# Altium project DummyLoadAddOn.PrjPcb
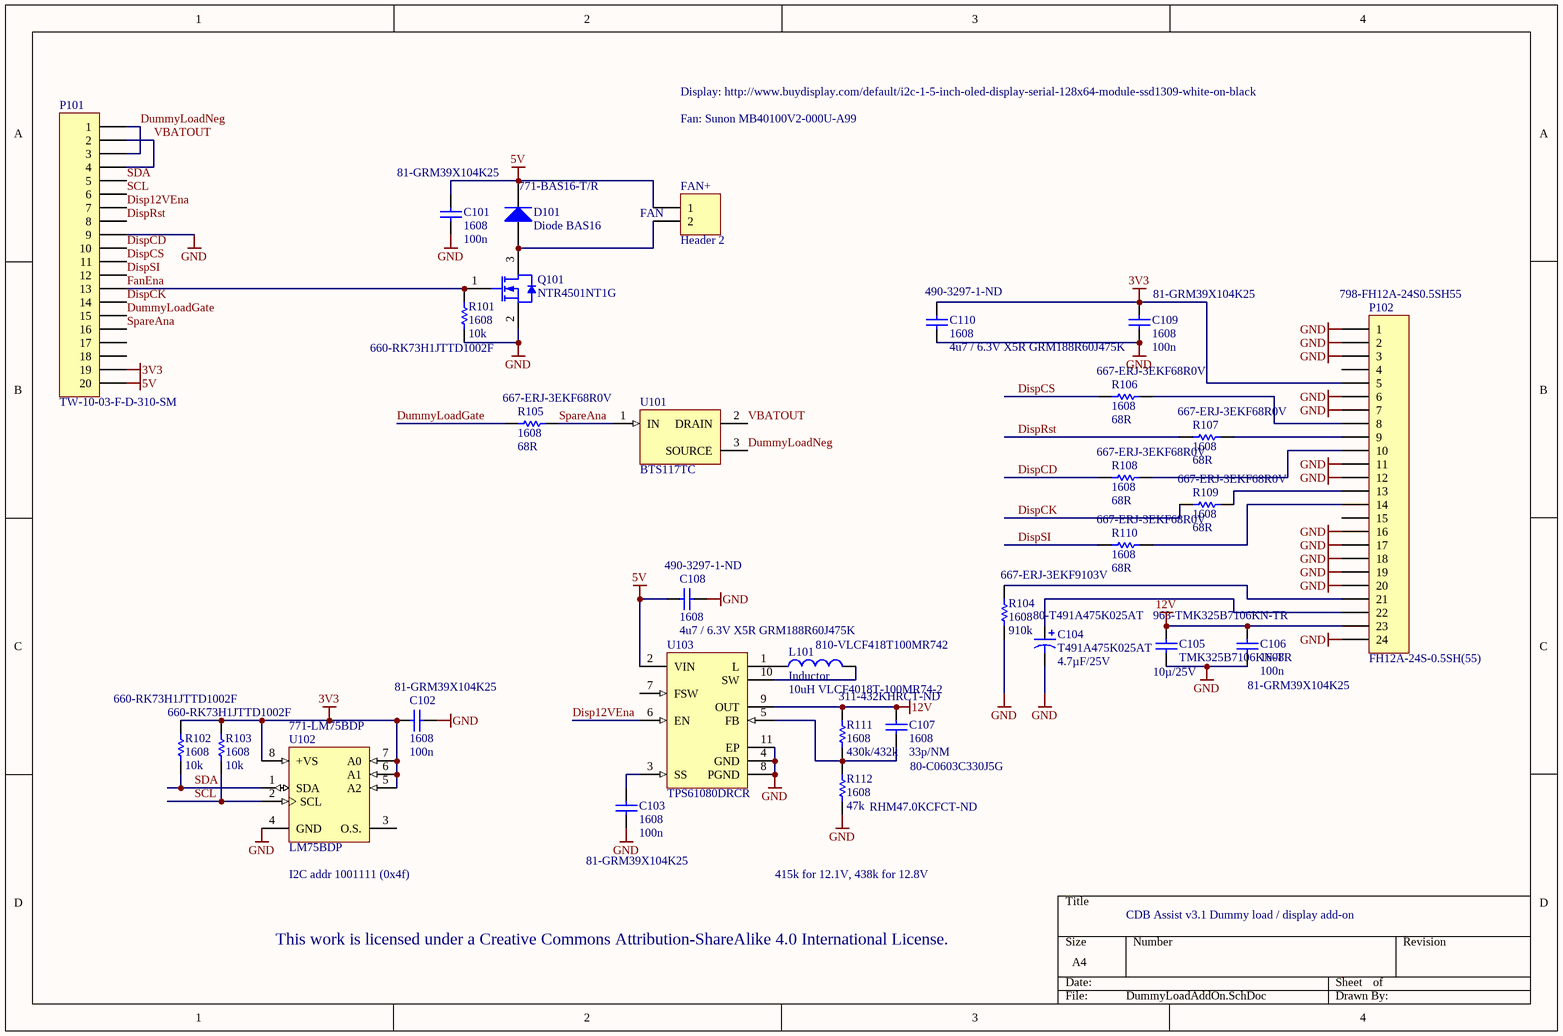
[diagram p0: DummyLoadAddOn.SchDoc]
1 sheet, 31 parts. Net scope: global (net labels, ports and power ports of the same name join across sheets).
Board file: DummyLoadAddOn.PcbDoc

## Sheet DummyLoadAddOn.SchDoc
size A4

### Parts
C101  1608  value 100n  Supplier Part Number 1: 81-GRM39X104K25  [RESC1608N]
C102  1608  value 100n  Supplier Part Number 1: 81-GRM39X104K25  [RESC1608N]
C103  1608  value 100n  Supplier Part Number 1: 81-GRM39X104K25  [RESC1608N]
C104  T491A475K025AT  value 4.7µF/25V  Supplier Part Number 1: 80-T491A475K025AT  [A_3216]
C105  TMK325B7106KN-TR  value 10µ/25V  Supplier Part Number 1: 963-TMK325B7106KN-TR  [CAPC3225N]
C106  1608  value 100n  Supplier Part Number 1: 81-GRM39X104K25  [RESC1608N]
C107  1608  value 33p/NM  Supplier Part Number 1: 80-C0603C330J5G  [RESC1608N]
C108  1608  value 4u7 / 6.3V X5R GRM188R60J475K  Supplier Part Number 1: 490-3297-1-ND  [RESC1608N]
C109  1608  value 100n  Supplier Part Number 1: 81-GRM39X104K25  [RESC1608N]
C110  1608  value 4u7 / 6.3V X5R GRM188R60J475K  Supplier Part Number 1: 490-3297-1-ND  [RESC1608N]
D101  Diode BAS16  Supplier Part Number 1: 771-BAS16-T/R  [SOT-23_N]
FAN+  Header 2  [HDR1X2]  (no BOM)
L101  Inductor  value 10uH VLCF4018T-100MR74-2  Supplier Part Number 1: 810-VLCF418T100MR742  [SRR4018]
P101  TW-10-03-F-D-310-SM  [Samtec TW-SM 20-pin]
P102  FH12A-24S-0.5SH(55)  Supplier Part Number 1: 798-FH12A-24S0.5SH55  [MI050DXK-24-1 - duplicate]
Q101  NTR4501NT1G  [ONSC-SOT-23-3-318-08_V]
R101  1608  value 10k  Supplier Part Number 1: 660-RK73H1JTTD1002F  [RESC1608N]
R102  1608  value 10k  Supplier Part Number 1: 660-RK73H1JTTD1002F  [RESC1608N]
R103  1608  value 10k  Supplier Part Number 1: 660-RK73H1JTTD1002F  [RESC1608N]
R104  1608  value 910k  Supplier Part Number 1: 667-ERJ-3EKF9103V  [RESC1608N]
R105  1608  value 68R  Supplier Part Number 1: 667-ERJ-3EKF68R0V  [RESC1608N]
R106  1608  value 68R  Supplier Part Number 1: 667-ERJ-3EKF68R0V  [RESC1608N]
R107  1608  value 68R  Supplier Part Number 1: 667-ERJ-3EKF68R0V  [RESC1608N]
R108  1608  value 68R  Supplier Part Number 1: 667-ERJ-3EKF68R0V  [RESC1608N]
R109  1608  value 68R  Supplier Part Number 1: 667-ERJ-3EKF68R0V  [RESC1608N]
R110  1608  value 68R  Supplier Part Number 1: 667-ERJ-3EKF68R0V  [RESC1608N]
R111  1608  value 430k/432k  Supplier Part Number 1: 311-432KHRCT-ND  [RESC1608N]
R112  1608  value 47k  Supplier Part Number 1: RHM47.0KCFCT-ND  [RESC1608N]
U101  BTS117TC  [INF-PG-TO263-3-2_N]
U102  LM75BDP  Supplier Part Number 1: 771-LM75BDP  [MUA08A_N]
U103  TPS61080DRCR  [TI-DRC10-2400X1650TP_V]

### Nets
3V3: C102.2 C109.1 C110.1 P101.19 P102.5 R102.2 R103.2 U102.5(A2) U102.6(A1) U102.7(A0) U102.8(+VS)
5V: C101.2 C108.2 D101.3(K) FAN+.1 P101.20 U103.2(VIN)
12V: C105.1 C106.2 C107.2 P102.23 R111.1 U103.9(OUT)
GND: C101.1 C102.1 C103.1 C104.2 C105.2 C106.1 C108.1 C109.2 C110.2 P101.9 P102.1 P102.2 P102.3 P102.6 P102.7 P102.11 P102.12 P102.16 P102.17 P102.18 P102.19 P102.20 P102.24 Q101.2(S) R101.1 R104.2 R112.2 U102.4(GND) U103.4(GND) U103.8(PGND) U103.11(EP)
Disp12VEna: P101.7 U103.6(EN)
DispCD: P101.10 R108.2
DispCK: P101.14 R109.2
DispCS: P101.11 R106.2
DispRst: P101.8 R107.2
DispSI: P101.12 R110.2
DummyLoadGate: P101.15 R105.2
DummyLoadNeg: P101.1 P101.3 U101.3(SOURCE)
FanEna: P101.13 Q101.1(G) R101.2
SCL: P101.6 R103.1 U102.2(SCL)
SDA: P101.5 R102.1 U102.1(SDA)
SpareAna: P101.16 R105.1 U101.1(IN)
VBATOUT: P101.2 P101.4 U101.2(DRAIN)
NetC103_2: C103.2 U103.3(SS)
NetC104_1: C104.1 P102.22
NetC107_1: C107.1 R111.2 R112.1 U103.5(FB)
NetD101_1: D101.1(A) FAN+.2 Q101.3(D)
NetL101_1: L101.1 U103.1(L)
NetL101_2: L101.2 U103.10(SW)
NetP102_8: P102.8 R106.1
NetP102_9: P102.9 R107.1
NetP102_10: P102.10 R108.1
NetP102_13: P102.13 R109.1
NetP102_14: P102.14 R110.1
NetP102_21: P102.21 R104.1

Not connected (* = marked no-connect by the designer): P101 17 18; P102 4 15; U102 3(O.S.); U103 7(FSW)

### Notes on the sheet
- Display: http://www.buydisplay.com/default/i2c-1-5-inch-oled-display-serial-128x64-module-ssd1309-white-on-black
- Fan: Sunon MB40100V2-000U-A99
- (near FAN+) FAN
- (near U102) I2C addr 1001111 (0x4f)
- 415k for 12.1V, 438k for 12.8V
- CDB Assist v3.1 Dummy load / display add-on
- This work is licensed under a Creative Commons Attribution-ShareAlike 4.0 International License.

### Library data of the parts
C101-C103 C106 C109 = Cap Semi: Capacitor (Semiconductor SIM Model); Manufacturer: Murata Electronics; Manufacturer Part Number: GRM188R71E104KA01D; Capacitance: 0.1 uF; Tolerance: 10 %; Type: General Purpose MLCC; Voltage Rating DC: 25 V; Case Height: 0.8 mm; Case Length: 1.6 mm; Dielectric: X7R; Temperature Coefficient / Code: +/- 15 %; Published: 8-Jun-2000; LatestRevisionDate: 29-May-2009; LatestRevisionNote: IPC-7351 Footprint Added.; PackageReference: C1206; Publisher: Altium Limited; PackageDescription: Chip Capacitor; Supplier 1: Mouser; RoHS: RoHS Compliant; Category: Multilayer Ceramic Capacitors MLCC - SMD/SMT; Stock 1: 1414567; Pricing 1: 1=0.100, 10=0.011, 100=0.007, 1000=0.005, 4000=0.004, 48000=0.003 (USD); Operating Temperature Range: - 55 C to + 125 C; Package / Case: 0603 (1608 metric); Packaging: Reel; Product: General Type MLCCs; Series: GRM; Termination Style: SMD/SMT; Brand: Murata Electronics; Case Code - in: 0603; Case Code - mm: 1608; Case Width: 0.8 mm; Maximum Operating Temperature: + 125 C; Minimum Operating Temperature: - 55 C; Product Category: Low & Medium Capacitance SMD Ceramic Chip Capacitors; Standard Pack Qty: 4000; RoHS - Mouser: Y; Minimum Order Quantity: 1; Reeling: True; ComponentLink1URL: http://www.murata.com/products/catalog/pdf/c02e.pdf; ComponentLink1Description: http://www.murata.com/products/catalog/pdf/c02e.pdf
C104 = T491A: Solid Tantalum Chip Capacitor, Standard T491 Series - Industrial Grade; Manufacturer: Kemet; Mfr Case Code: A Case; Capacitance: 4.7 uF; Tolerance: 10 %; Voltage Rating: 25 V; Case Length: 3.2 mm; Case Width: 1.6 mm; Published: 17-Jul-2002; LatestRevisionDate: 19-Mar-2004; LatestRevisionNote: Silkscreen dimensions re-sized.; DatasheetDocument: Mar-2001; PackageDocument: Mar-2001; PackageReference: A; Publisher: Altium Limited; Code_JEITA: 3216-18; ComponentLink1Description: Manufacturer Link; ComponentLink1URL: http://www.kemet.com/; ComponentLink2Description: Datasheet; ComponentLink2URL: http://www.kemet.com/kemet/web/homepage/kechome.nsf/vapubfilesname/F3102TA.pdf/$file/F3102TA.pdf; Supplier 1: Mouser; Manufacturer Part Number: T491A475K025AT; RoHS: RoHS Compliant; Category: Tantalum Capacitors - Solid SMD; Stock 1: 10849; Pricing 1: 1=0.430, 10=0.230, 100=0.138, 1000=0.125, 2000=0.092, 10000=0.085, 24000=0.082, 50000=0.077, 100000=0.071 (USD); Height: 1.8 mm; Operating Temperature Range: - 55 C to + 125 C; Package / Case: 1206 (3216 metric); Packaging: Reel; Product: Tantalum Solid Standard Grade - Other Various; Series: T491; Termination Style: SMD/SMT; Brand: Kemet; Case Code - in: 1206; Case Code - mm: 3216; Product Category: SMD Tantalum Chip Capacitors; Standard Pack Qty: 2000; RoHS - Mouser: Y; Minimum Order Quantity: 1; Reeling: True; ComponentLink3URL: http://www.mouser.com/ds/2/212/KEM_T2005_T491-533941.pdf; ComponentLink3Description: http://www.mouser.com/ds/2/212/KEM_T2005_T491-533941.pdf
C105 = cap: Capacitor; Manufacturer: Taiyo Yuden; Capacitance: 10 uF; Tolerance: 10 %; Type: Multilayer Ceramic Capacitor; Voltage Rating DC: 25 V; Case Height: 1.9 mm; Case Length: 3.2 mm; Case Width: 2.5 mm; Dielectric: X7R; Temperature Coefficient / Code: +/- 15 %; Published: 8-Jun-2000; LatestRevisionDate: 17-Jul-2002; LatestRevisionNote: Re-released for DXP Platform.; PackageReference: RAD-0.3; Publisher: Altium Limited; Supplier 1: Mouser; Manufacturer Part Number: TMK325B7106KN-TR; RoHS: RoHS Compliant; Category: Multilayer Ceramic Capacitors MLCC - SMD/SMT; Stock 1: 26759; Pricing 1: 1=0.480, 10=0.255, 100=0.153, 1000=0.138, 2000=0.102, 10000=0.093, 24000=0.090, 50000=0.084, 100000=0.078 (USD); Operating Temperature Range: - 55 C to + 125 C; Package / Case: 1210 (3225 metric); Packaging: Reel; Product: General Type MLCCs; Series: M; Termination Style: SMD/SMT; Brand: Taiyo Yuden; Case Code - in: 1210; Case Code - mm: 3225; Maximum Operating Temperature: + 125 C; Minimum Operating Temperature: - 55 C; Standard Pack Qty: 2000; RoHS - Mouser: Y; Minimum Order Quantity: 1; Reeling: True; ComponentLink1URL: http://www.yuden.co.jp/productdata/catalog/en/mlcc01_e.pdf; ComponentLink1Description: http://www.yuden.co.jp/productdata/catalog/en/mlcc01_e.pdf
C107 = Cap Semi: Capacitor (Semiconductor SIM Model); Manufacturer: Kemet; Manufacturer Part Number: C0603C330J5GACTU; Capacitance: 33 pF; Tolerance: 5 %; Type: SMD MLCC C0G 10 - 250 VDC Commercial Grade; Voltage Rating DC: 50 V; Case Length: 1.6 mm; Case Width: 0.8 mm; Class: Class 1; Dielectric: C0G (NP0); Dissipation Factor DF: 0.1; Temperature Coefficient / Code: +/- 30 PPM / C; Published: 8-Jun-2000; LatestRevisionDate: 29-May-2009; LatestRevisionNote: IPC-7351 Footprint Added.; PackageReference: C1206; Publisher: Altium Limited; PackageDescription: Chip Capacitor; Supplier 1: Mouser; RoHS: RoHS Compliant; Category: Multilayer Ceramic Capacitors MLCC - SMD/SMT; Stock 1: 167004; Pricing 1: 1=0.100, 10=0.014, 100=0.009, 4000=0.006, 24000=0.005, 48000=0.004, 100000=0.003 (USD); Operating Temperature Range: - 55 C to + 125 C; Package / Case: 0603 (1608 metric); Packaging: Reel; Product: General Type MLCCs; Series: C0603C; Termination Style: SMD/SMT; Voltage Rating AC: -; Brand: Kemet; Case Code - in: 0603; Case Code - mm: 1608; Case Height: -; Lead Spacing: 0.7 mm; Maximum Operating Temperature: + 125 C; Minimum Operating Temperature: - 55 C; Product Category: 0603 SMD Ceramic Chip Capacitors; Standard Pack Qty: 4000; RoHS - Mouser: Y; Minimum Order Quantity: 1; Reeling: True; ComponentLink1URL: http://www.kemet.com/Lists/ProductCatalog/Attachments/46/KEM_C1003_C0G_SMD.pdf; ComponentLink1Description: http://www.kemet.com/Lists/ProductCatalog/Attachments/46/KEM_C1003_C0G_SMD.pdf
C108 C110 = Cap Semi: Capacitor (Semiconductor SIM Model); Manufacturer: Murata Electronics North America; Manufacturer Part Number: GRM188R60J475KE19D; Capacitance: 4.7µF; Tolerance: ±10%; Voltage - Rated: 6.3V; Temperature Coefficient: X5R; Published: 8-Jun-2000; LatestRevisionDate: 29-May-2009; LatestRevisionNote: IPC-7351 Footprint Added.; PackageReference: C1206; Publisher: Altium Limited; PackageDescription: Chip Capacitor; Supplier 1: Digi-Key; RoHS: RoHS Compliant; Category: Capacitors; Stock 1: 658756; Pricing 1: 1=0.12, 10=0.08, 50=0.046, 100=0.038, 250=0.032, 500=0.0268, 1000=0.022 (USD); Packaging: Cut Tape (CT); Mounting Type: Surface Mount, MLCC; Operating Temperature: -55°C ~ 85°C; Applications: General Purpose; Ratings: -; Package / Case: 0603 (1608 Metric); Size / Dimension: 0.063" L x 0.031" W (1.60mm x 0.80mm); Height - Seated (Max): -; Thickness (Max): 0.035" (0.90mm); Lead Spacing: -; Features: -; Lead Style: -; ComponentLink1URL: http://www.murata.com/~/media/webrenewal/support/library/catalog/products/capacitor/mlcc/c02e.ashx; ComponentLink1Description: http://www.murata.com/~/media/webrenewal/support/library/catalog/products/capacitor/mlcc/c02e.ashx
D101 = Diode BAS16: Silicon Switching Diode for High-Speed Switching; Manufacturer: NXP Semiconductors; Manufacturer Part Number: BAS16,215; Note: Pin 2 is not connected and not drawn.; Configuration: Single; Forward Continuous Current: 0.215 A; Max Surge Current: 4 A; Recovery Time: 4 ns; Forward Voltage Drop: 1.25 V at 0.15 A; Maximum Reverse Leakage Current: 0.5 uA at 80 V; Peak Reverse Voltage: 100 V; Published: 21-Mar-2003; LatestRevisionDate: 29-May-2009; LatestRevisionNote: IPC-7351 Footprint Added.; DatasheetVersion: Oct-1999; PackageVersion: Sep-2001; PackageReference: SOT-23; Publisher: Altium Limited; PackageDescription: 3-Pin SOT-23 Package 0.95 mm Pitch, 2.5 mm Lead Span; ComponentLink1Description: Manufacturer Link; ComponentLink1URL: http://www.infineon.com/; ComponentLink2Description: Datasheet; ComponentLink2URL: http://www.infineon.com/upload/Document/cmc_upload/documents/012/5331/bas16series.pdf; Supplier 1: Mouser; RoHS: RoHS Compliant; Category: Diodes - General Purpose, Power, Switching; Stock 1: 101735; Pricing 1: 1=0.130, 10=0.112, 100=0.039, 1000=0.027, 3000=0.020, 9000=0.017, 24000=0.016, 45000=0.014, 99000=0.012 (USD); Operating Temperature Range: + 150 C; Package / Case: TO-236AB; Packaging: Reel; Product: Switching Diodes; Brand: NXP Semiconductors; Mounting Style: SMD/SMT; Maximum Operating Temperature: + 150 C; Minimum Operating Temperature: - 65 C; Product Category: Diodes & Rectifiers - Single; Standard Pack Qty: 3000; RoHS - Mouser: Y; Minimum Order Quantity: 1; Reeling: True; ComponentLink3URL: http://www.mouser.com/ds/2/302/BAS16_SER-354545.pdf; ComponentLink3Description: http://www.mouser.com/ds/2/302/BAS16_SER-354545.pdf
FAN+ = Header 2: Header, 2-Pin; LatestRevisionDate: 17-Jul-2002; LatestRevisionNote: Re-released for DXP Platform.; Publisher: Altium Limited
L101 = Inductor: Manufacturer: TDK; Manufacturer Part Number: VLCF4018T-100MR74-2; Code_IEC: 1005; Inductance: 10 uH; Maximum DC Current: 740 mA; Maximum DC Resistance: 188 mOhms; Shielding: Shielded; Tolerance: 20 %; Case Height: 1.8 mm; Case Length: 4 mm; Test Frequency: 100 kHz; Published: 8-Jun-2000; LatestRevisionDate: 29-May-2009; LatestRevisionNote: IPC-7351 Footprint Added.; PackageReference: 0402-A; Publisher: Altium Limited; PackageDescription: Chip Inductor; Code_JEITA: 0402; Supplier 1: Mouser; RoHS: RoHS Compliant; Category: Fixed Inductors; Stock 1: 2442; Pricing 1: 1=0.900, 10=0.650, 100=0.520, 1000=0.340, 2000=0.310, 10000=0.300, 25000=0.290 (USD); Operating Temperature Range: - 40 C to + 105 C; Packaging: Reel; Product: Power Inductors; Series: VLCF; Termination Style: SMD/SMT; Brand: TDK; Case Width: 4 mm; Product Category: Wound SMD Inductors; Standard Pack Qty: 1000; RoHS - Mouser: Y; Minimum Order Quantity: 1; Reeling: True; ComponentLink1URL: http://www.mouser.com/ds/2/400/e531_vlcf-18500.pdf; ComponentLink1Description: http://www.mouser.com/ds/2/400/e531_vlcf-18500.pdf
P101 = Header 20: Header, 20-Pin; LatestRevisionDate: 17-Jul-2002; LatestRevisionNote: Re-released for DXP Platform.; Publisher: Altium Limited
P102 = Header 24: FPC 24-pin Display; Manufacturer: Hirose Connector; Current Rating: 500 mA; Gender: Female; Mounting Angle: Right; Number of Positions: 24; Voltage Rating: 50 V; Pitch: 0.5 mm; Contact Location: Top Contact; LatestRevisionDate: 17-Jul-2002; LatestRevisionNote: Re-released for DXP Platform.; Publisher: Altium Limited; Supplier 1: Mouser; Manufacturer Part Number: FH12A-24S-0.5SH(55); RoHS: RoHS Compliant; Category: FFC & FPC Connectors; Stock 1: 2070; Pricing 1: 1=2.10, 10=1.71, 100=1.64, 250=1.48, 500=1.36, 1000=1.17, 2000=0.994, 4000=0.944, 10000=0.923 (USD); Contact Plating: Gold; Housing Material: Liquid Crystal Polymer (LCP); Packaging: Reel; Series: FH12; Termination Style: SMD; Brand: Hirose Connector; Contact Material: Phosphor Bronze; Product Category: FFC/FPC Connectors; Product Type: Board Mount; Standard Pack Qty: 2000; RoHS - Mouser: Y; Minimum Order Quantity: 1; Reeling: True; ComponentLink1URL: http://www.mouser.com/ds/2/185/ed_FH12_20140305-355586.pdf; ComponentLink1Description: http://www.mouser.com/ds/2/185/ed_FH12_20140305-355586.pdf
Q101 = NTR4501NT1G: Power MOSFET, 20 V, 3.2 A, Single N-Channel, 3-Pin SOT-23, Pb-Free, Tape and Reel; Manufacturer: On Semiconductor; Channel Polarity: N Channel; Ciss Typ (pF): 200; Coss Typ (pF): 80; Crss Typ (pF): 50; PD Max (W): 1.25; Qrr Typ (nC): 3; V(BR)DSS Min (V): 20; VGS Max (V): 12; VGS(th) Max (V): 1.2; DatasheetVersion: Rev. 13; PackageVersion: Rev. AP, 11/2009; PackageReference: SOT-23-3-318-08; PackageDescription: 3-Pin Small Outline Transistor, Body 2.92 x 1.3 mm, Pitch 0.95 mm; Supplier 1: Digi-Key; Supplier Part Number 1: NTR4501NT1GOSTR-ND; Supplier 2: Digi-Key; Supplier Part Number 2: NTR4501NT1GOSCT-ND; Supplier 3: Digi-Key; Supplier Part Number 3: NTR4501NT1GOSDKR-ND; Supplier 4: Farnell; Supplier Part Number 4: 1431305; Supplier 5: Farnell; Supplier Part Number 5: 1431305RL; Supplier 6: Newark; Supplier Part Number 6: 45J2175; Supplier 7: Newark; Supplier Part Number 7: 06R3476; Supplier 8: Mouser; Supplier Part Number 8: 863-NTR4501NT1G; Configuration: Single; Package Type: SOT-23-3; Packing: Tape and Reel; RoHS: Pb-Free; Mounting Technology: Surface Mount; PartNumber: NTR4501NT1G; ComponentLink1Description: Manufacturer URL; ComponentLink1URL: http://www.onsemi.com/; ComponentLink2Description: Datasheet; ComponentLink2URL: http://www.onsemi.cn/pub_link/Collateral/NTR4501N-D.PDF; ComponentLink3Description: Package Specification; ComponentLink3URL: http://www.onsemi.cn/pub_link/Collateral/318-08.PDF
R101-R103 = Res Semi: Semiconductor Resistor; Manufacturer: KOA Speer; Manufacturer Part Number: RK73H1JTTD1002F; Power Rating: 100 mW; Resistance: 10 kOhms; Temperature Coefficient: 100 PPM / C; Tolerance: 1 %; Voltage Rating: 50 V; Case Height: 0.45 mm; Case Length: 1.6 mm; Case Width: 0.8 mm; Published: 8-Jun-2000; LatestRevisionDate: 17-Jul-2002; LatestRevisionNote: Re-released for DXP Platform.; PackageReference: AXIAL-0.5; Publisher: Altium Limited; PackageDescription: Axial Device, Thru-Hole; 2 Leads; 0.5 in Pin Spacing; Supplier 1: Mouser; RoHS: RoHS Compliant By Exemption; Category: Thick Film Resistors - SMD; Stock 1: 1842375; Pricing 1: 1=0.100, 10=0.013, 100=0.007, 500=0.005, 1000=0.004, 5000=0.003, 50000=0.002 (USD); Operating Temperature Range: - 55 C to + 155 C; Package / Case: 0603 (1608 metric); Packaging: Reel; Product: Thick Film Resistors SMD; Series: RK73H; Brand: KOA Speer; Case Code - in: 0603; Case Code - mm: 1608; Product Category: 0603 SMD Thick Film Chip Resistors; Standard Pack Qty: 5000; RoHS - Mouser: E; Minimum Order Quantity: 1; Reeling: True; ComponentLink1URL: http://www.koaspeer.com/catimages/Products/RK73H/RK73H.pdf; ComponentLink1Description: http://www.koaspeer.com/catimages/Products/RK73H/RK73H.pdf
R104 = Res Semi: Semiconductor Resistor; Manufacturer: Panasonic; Manufacturer Part Number: ERJ-3EKF9103V; Power Rating: 100 mW; Resistance: 910 kOhms; Tolerance: 1 %; Voltage Rating: 75 V; Case Height: 0.45 mm; Case Length: 1.6 mm; Case Width: 0.8 mm; Published: 8-Jun-2000; LatestRevisionDate: 17-Jul-2002; LatestRevisionNote: Re-released for DXP Platform.; PackageReference: AXIAL-0.5; Publisher: Altium Limited; PackageDescription: Axial Device, Thru-Hole; 2 Leads; 0.5 in Pin Spacing; Supplier 1: Mouser; RoHS: RoHS Compliant By Exemption; Category: Thick Film Resistors - SMD; Stock 1: 67873; Pricing 1: 1=0.100, 10=0.015, 100=0.006, 1000=0.004, 5000=0.002 (USD); Operating Temperature Range: - 55 C to + 155 C; Package / Case: 0603 (1608 metric); Packaging: Reel; Product: Thick Film Resistors SMD; Series: ERJ; Type: Precision Thick Film Resistors SMD; Brand: Panasonic; Case Code - in: 0603; Case Code - mm: 1608; Standard Pack Qty: 5000; RoHS - Mouser: E; Minimum Order Quantity: 1; Reeling: True; ComponentLink1URL: http://industrial.panasonic.com/www-data/pdf/AOA0000/AOA0000CE2.pdf; ComponentLink1Description: http://industrial.panasonic.com/www-data/pdf/AOA0000/AOA0000CE2.pdf
R105-R110 = Res Semi: Semiconductor Resistor; Manufacturer: Panasonic; Manufacturer Part Number: ERJ-3EKF68R0V; Power Rating: 100 mW; Resistance: 68 Ohms; Tolerance: 1 %; Voltage Rating: 75 V; Case Height: 0.45 mm; Case Length: 1.6 mm; Case Width: 0.8 mm; Published: 8-Jun-2000; LatestRevisionDate: 17-Jul-2002; LatestRevisionNote: Re-released for DXP Platform.; PackageReference: AXIAL-0.5; Publisher: Altium Limited; PackageDescription: Axial Device, Thru-Hole; 2 Leads; 0.5 in Pin Spacing; Supplier 1: Mouser; RoHS: RoHS Compliant By Exemption; Category: Thick Film Resistors - SMD; Stock 1: 159748; Pricing 1: 1=0.100, 10=0.015, 100=0.008, 500=0.006, 1000=0.004, 5000=0.002 (USD); Operating Temperature Range: - 55 C to + 155 C; Package / Case: 0603 (1608 metric); Packaging: Reel; Product: Thick Film Resistors SMD; Series: ERJ; Type: Precision Thick Film Resistors SMD; Brand: Panasonic; Case Code - in: 0603; Case Code - mm: 1608; Standard Pack Qty: 5000; RoHS - Mouser: E; Minimum Order Quantity: 1; Reeling: True; ComponentLink1URL: http://industrial.panasonic.com/www-data/pdf/AOA0000/AOA0000CE2.pdf; ComponentLink1Description: http://industrial.panasonic.com/www-data/pdf/AOA0000/AOA0000CE2.pdf
R111 = Res Semi: Semiconductor Resistor; Manufacturer: Yageo; Manufacturer Part Number: RC0603FR-07432KL; Resistance (Ohms): 432k; Tolerance: ±1%; Power (Watts): 0.1W, 1/10W; Temperature Coefficient: ±100ppm/°C; Published: 8-Jun-2000; LatestRevisionDate: 17-Jul-2002; LatestRevisionNote: Re-released for DXP Platform.; PackageReference: AXIAL-0.5; Publisher: Altium Limited; PackageDescription: Axial Device, Thru-Hole; 2 Leads; 0.5 in Pin Spacing; Supplier 1: Digi-Key; RoHS: RoHS Compliant; Category: Resistors; Stock 1: 43309; Pricing 1: 1=0.1, 10=0.015, 25=0.0108, 100=0.006, 250=0.00456, 500=0.00364, 1000=0.00268, 2500=0.00233 (USD); Packaging: Cut Tape (CT); Composition: Thick Film; Features: Moisture Resistant; Operating Temperature: -55°C ~ 155°C; Package / Case: 0603 (1608 Metric); Supplier Device Package: 0603; Size / Dimension: 0.063" L x 0.031" W (1.60mm x 0.80mm); Height: 0.022" (0.55mm); Number of Terminations: 2; ComponentLink1URL: http://www.yageo.com/documents/recent/PYu-RC_Group_51_RoHS_L_1.pdf; ComponentLink1Description: http://www.yageo.com/documents/recent/PYu-RC_Group_51_RoHS_L_1.pdf
R112 = Res Semi: Semiconductor Resistor; Manufacturer: Rohm Semiconductor; Manufacturer Part Number: MCR03ERTF4702; Tolerance: ±1%; Power (Watts): 0.1W, 1/10W; Temperature Coefficient: ±100ppm/°C; Published: 8-Jun-2000; LatestRevisionDate: 17-Jul-2002; LatestRevisionNote: Re-released for DXP Platform.; PackageReference: AXIAL-0.5; Publisher: Altium Limited; PackageDescription: Axial Device, Thru-Hole; 2 Leads; 0.5 in Pin Spacing; Supplier 1: Digi-Key; RoHS: RoHS Compliant; Category: Resistors; Stock 1: 69194; Pricing 1: 1=0.1, 10=0.011, 25=0.0084, 100=0.0047, 250=0.00356, 500=0.00286, 1000=0.0021 (USD); Packaging: Cut Tape (CT); Resistance (Ohms): 47k; Composition: Thick Film; Features: -; Operating Temperature: -55°C ~ 155°C; Package / Case: 0603 (1608 Metric); Supplier Device Package: 0603 (1608 Metric); Size / Dimension: 0.063" L x 0.031" W (1.60mm x 0.80mm); Height: 0.022" (0.55mm); Number of Terminations: 2; ComponentLink1URL: http://rohmfs.rohm.com/en/products/databook/datasheet/passive/resistor/chip_resistor/mcr_g.pdf; ComponentLink1Description: http://rohmfs.rohm.com/en/products/databook/datasheet/passive/resistor/chip_resistor/mcr_g.pdf
U101 = BTS117TC: Smart Low-Side Power Switch HITFET, 60 V VDS, 3.5 A ID, -40 to 150 degC, PG-TO263-3-2, Reel, Green; Manufacturer: Infineon; Channels: 1; Green: TRUE; ID: 3.5 A; ID(lim) (min): 7 A; ISC (max): 25 A; Ptot (max): 50 mW; RDS (on)(max): 100 mOhm; ton (max): 70 us; toff (max): 150 us; VDS (max): 60 V; DatasheetVersion: Rev. 1.0; PackageVersion: Jul-09; PackageReference: PG-TO263-3-2; PackageDescription: 3-Pin Plastic (Green) Transistor Single Outline Package, 10 x 9.25 mm Body, 2.54 mm Pitch; Supplier 1: Digi-Key; Supplier Part Number 1: BTS117TCTR-ND; Supplier 2: Digi-Key; Supplier Part Number 2: BTS117TCCT-ND; Supplier 3: Digi-Key; Supplier Part Number 3: BTS117TCDKR-ND; Supplier 4: Mouser; Supplier Part Number 4: 726-BTS117TC; Group: HITFET; Halogen-free: FALSE; ID(nom): 3.5 A; Packing: Reel; Mounting Technology: Surface Mount; PartNumber: BTS117TC; ComponentLink1Description: Manufacturer URL; ComponentLink1URL: http://www.infineon.com/; ComponentLink2Description: Datasheet; ComponentLink2URL: http://www.infineon.com/dgdl/BTS117TC_DS_10.pdf?folderId=db3a3043163797a6011667aa084c0e01&fileId=db3a3043242ebc9e01242f3d87500018&location=en.Products.Automotive_ICs.Smart_High-_and_Low-Side_Switches.HITFET___TEMPFET__-_Smart_Low-Side_Switches.DATASHEET.BTS117TC_DS_10.pdf; ComponentLink3Description: Package Specification; ComponentLink3URL: http://www.infineon.com/dgdl/BTS141TC_DS_10.pdf?folderId=db3a3043163797a6011667aa084c0e01&fileId=db3a3043242ebc9e01242f43f58b003e&location=en.Products.Automotive_ICs.Smart_High-_and_Low-Side_Switches.HITFET___TEMPFET__-_Smart_Low-Side_Switches.DATASHEET.BTS141TC_DS_10.pdf
U102 = LM75BIMM-3/NOPB: Digital Temperature Sensor and Thermal Watchdog with Two-Wire Interface, 8-pin Mini SOIC, Pb-Free; Manufacturer: National Semiconductor; Manufacturer Part Number: LM75BDP,118; PackageTopMarking: ZXTT*T01B; PowerWise: N; CompType: Temp Sensor IC; High-Reliability: Y; Accuracy: +/- 3 C; Configuration: Local; Device Function: Sensor with Overtemp; Supply Current: 100 uA; Brand: NXP Semiconductors; Digital Output - Bus Interface: 2-Wire, I2C, SMBus; Digital Output - Number of Bits: 11 bit; Temperature Threshold: Programmable; Supply Voltage - Max: 5.5 V; Supply Voltage - Min: 2.8 V; DatasheetVersion: Jul-2009; PackageVersion: revF, Apr-2008; PackageReference: MUA08A; PackageDescription: MINI SOIC, .118 x .118 x .034in, 8 Lead, .0256in Pitch; PartNumber: LM75BIMM-3/NOPB; RoHS: Y; PinCount: 8; Code_JEDEC: MO-187-AA; ComponentLink1Description: Manufacturer URL; ComponentLink1URL: http://www.national.com/; ComponentLink2Description: LM75B Datasheet; ComponentLink2URL: http://www.national.com/ds/LM/LM75B.pdf; ComponentLink3Description: LM75B Web Page; ComponentLink3URL: http://www.national.com/pf/LM/LM75B.html; ComponentLink4Description: MUA08A Package Page; ComponentLink4URL: http://www.national.com/packaging/folders/mua08a.html; Supplier 1: Mouser; Category: Board Mount Temperature Sensors; Stock 1: 6256; Pricing 1: 1=0.590, 10=0.428, 100=0.300, 1000=0.240, 2500=0.202, 10000=0.195, 25000=0.188, 50000=0.185 (USD); Output Type: Digital; Package / Case: TSSOP-8; Packaging: Reel; Mounting Style: SMD/SMT; Shutdown: Shutdown; Maximum Operating Temperature: + 125 C; Minimum Operating Temperature: - 55 C; Product Category: Sensors - Temperature; Standard Pack Qty: 2500; RoHS - Mouser: Y; Minimum Order Quantity: 1; Reeling: True; ComponentLink5URL: http://www.mouser.com/ds/2/302/LM75B-354043.pdf; ComponentLink5Description: http://www.mouser.com/ds/2/302/LM75B-354043.pdf
U103 = TPS61080DRCR: 27 V, 500 mA Switch, 1.2 MHz Boost Converter with Integrated Power Diode, 2.5 to 6 V, -40 to 85 degC, 10-pin SON (DRC10), Green (RoHS & no Sb/Br); Manufacturer: Texas Instruments; Iout(Max)(A): 0.2; Iq(Typ)(mA): 6; Rating: Catalog; SubFamily: White LED Driver; Switching Frequency(Max)(kHz): 1200; Synchronous Rectification: TRUE; Vin(Min)(V): 2.5; DatasheetVersion: SLVS644C; PackageVersion: 4204102-3/L; PackageReference: DRC10-2400X1650TP; PackageDescription: 10-Pin Plastic Small Outline, Body 3 x 3 mm, Pitch 0.5 mm; Supplier 1: Digi-Key; Supplier Part Number 1: 296-27010-2-ND; Supplier 2: Digi-Key; Supplier Part Number 2: 296-27010-1-ND; Supplier 3: Digi-Key; Supplier Part Number 3: 296-27010-6-ND; Supplier 4: Newark; Supplier Part Number 4: 30M1830; Supplier 5: Mouser; Supplier Part Number 5: 595-TPS61080DRCR; Eco-Plan: Green (RoHS & no Sb/Br); Topology: Boost; Vin(Max)(V): 6; Mounting Technology: Surface Mount; PartNumber: TPS61080DRCR; ComponentLink1Description: Manufacturer URL; ComponentLink1URL: http://www.ti.com/; ComponentLink2Description: Datasheet; ComponentLink2URL: http://www.ti.com/general/docs/lit/getliterature.tsp?genericPartNumber=TPS61080&fileType=pdf; ComponentLink3Description: Package Specification; ComponentLink3URL: http://www.ti.com/litv/pdf/mpds117k